# EAGLE design rfLED2 (EAGLE 9.2.2)
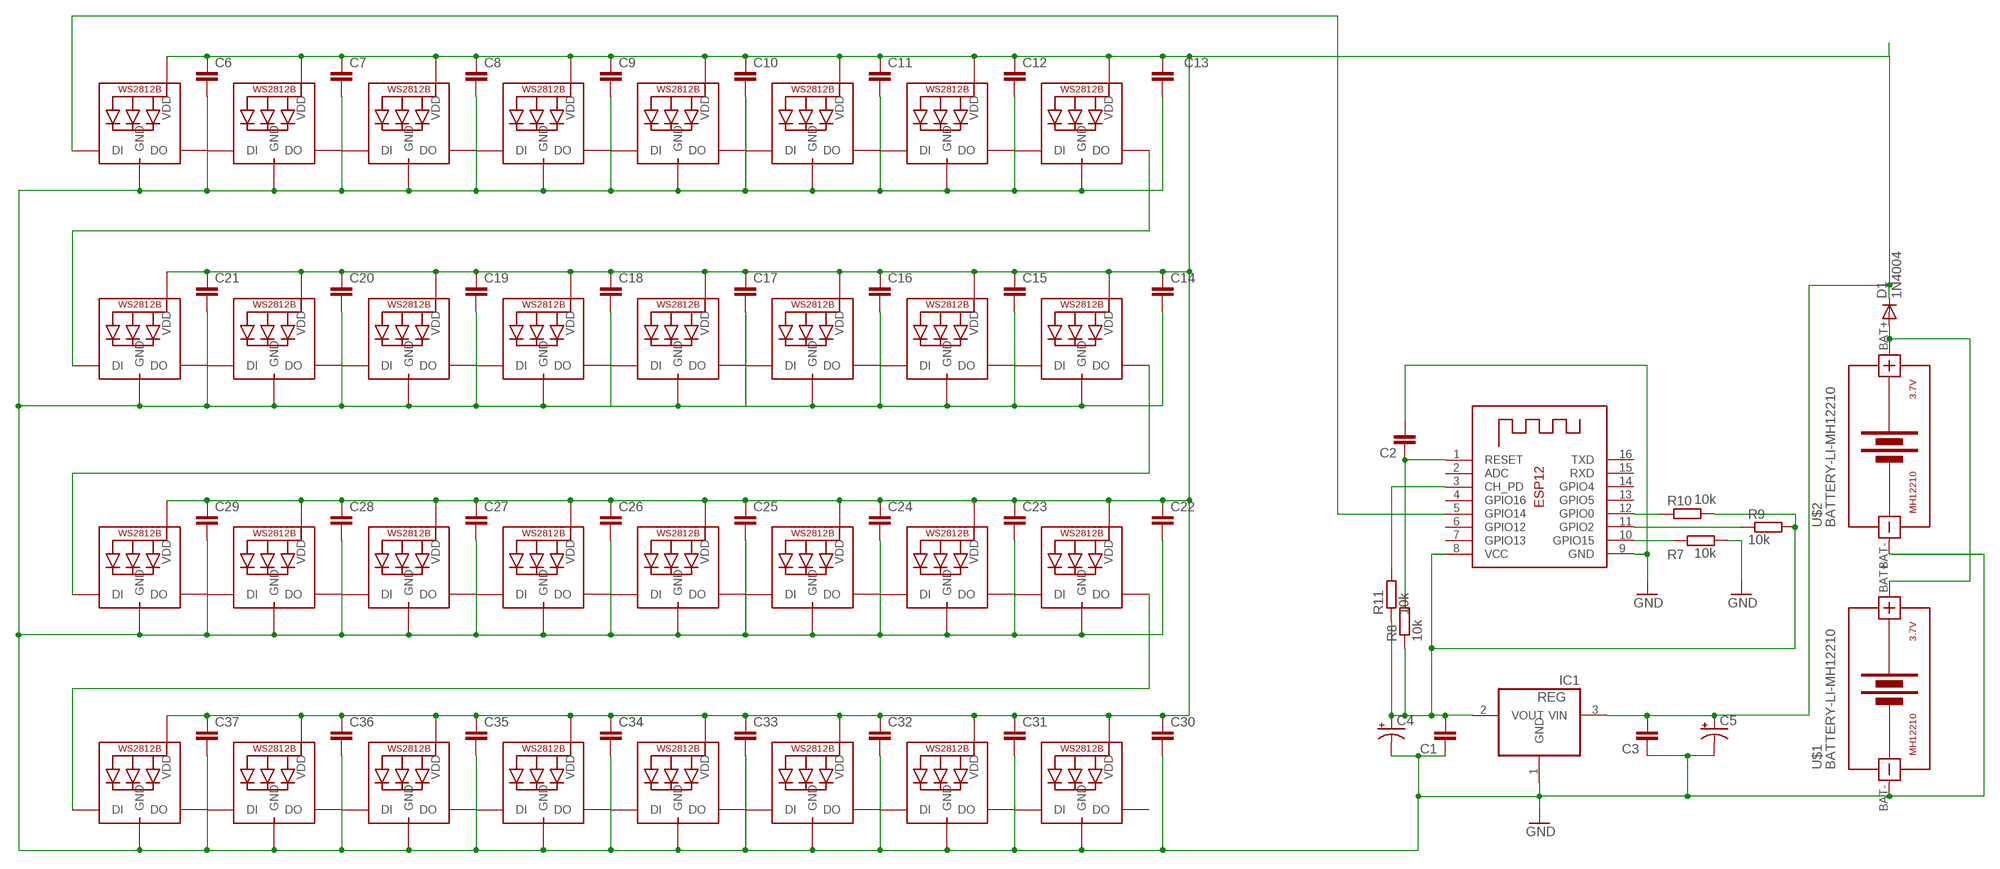
[diagram p0: schematic, sheet 1]

## Parts
C1  C  [C0805]
C2  C  [C0805]
C3  C  [C0805]
C4  CPOL-US150CLZ-1010  [150CLZ-1010]
C5  CPOL-US150CLZ-1010  [150CLZ-1010]
C6  C  [C0805]
C7  C  [C0805]
C8  C  [C0805]
C9  C  [C0805]
C10  C  [C0805]
C11  C  [C0805]
C12  C  [C0805]
C13  C  [C0805]
C14  C  [C0805]
C15  C  [C0805]
C16  C  [C0805]
C17  C  [C0805]
C18  C  [C0805]
C19  C  [C0805]
C20  C  [C0805]
C21  C  [C0805]
C22  C  [C0805]
C23  C  [C0805]
C24  C  [C0805]
C25  C  [C0805]
C26  C  [C0805]
C27  C  [C0805]
C28  C  [C0805]
C29  C  [C0805]
C30  C  [C0805]
C31  C  [C0805]
C32  C  [C0805]
C33  C  [C0805]
C34  C  [C0805]
C35  C  [C0805]
C36  C  [C0805]
C37  C  [C0805]
D1  1N4004  [DO41-10]
IC1  REG  REG1117  [SOT223]
LED1  WS2812B5050  [WS2812B]
LED2  WS2812B5050  [WS2812B]
LED3  WS2812B5050  [WS2812B]
LED4  WS2812B5050  [WS2812B]
LED5  WS2812B5050  [WS2812B]
LED6  WS2812B5050  [WS2812B]
LED7  WS2812B5050  [WS2812B]
LED8  WS2812B5050  [WS2812B]
LED9  WS2812B5050  [WS2812B]
LED10  WS2812B5050  [WS2812B]
LED11  WS2812B5050  [WS2812B]
LED12  WS2812B5050  [WS2812B]
LED13  WS2812B5050  [WS2812B]
LED14  WS2812B5050  [WS2812B]
LED15  WS2812B5050  [WS2812B]
LED16  WS2812B5050  [WS2812B]
LED17  WS2812B5050  [WS2812B]
LED18  WS2812B5050  [WS2812B]
LED19  WS2812B5050  [WS2812B]
LED20  WS2812B5050  [WS2812B]
LED21  WS2812B5050  [WS2812B]
LED22  WS2812B5050  [WS2812B]
LED23  WS2812B5050  [WS2812B]
LED24  WS2812B5050  [WS2812B]
LED25  WS2812B5050  [WS2812B]
LED26  WS2812B5050  [WS2812B]
LED27  WS2812B5050  [WS2812B]
LED28  WS2812B5050  [WS2812B]
LED29  WS2812B5050  [WS2812B]
LED30  WS2812B5050  [WS2812B]
LED31  WS2812B5050  [WS2812B]
LED32  WS2812B5050  [WS2812B]
R7  10k  RR1206  [R1206]
R8  10k  RR1206  [R1206]
R9  10k  RR1206  [R1206]
R10  10k  RR1206  [R1206]
R11  10k  RR1206  [R1206]
U$1  BATTERY-LI-MH12210  [BATTERY-LI-MH12210]
U$2  BATTERY-LI-MH12210  [BATTERY-LI-MH12210]
X1  ESP-12  [ESP-12]

## Nets
GND: C1.1 C2.2 C3.1 C4.- C5.- C6.2 C7.2 C8.2 C9.2 C10.2 C11.2 C12.2 C13.2 C14.2 C15.2 C16.2 C17.2 C18.2 C19.2 C20.2 C21.2 C22.2 C23.2 C24.2 C25.2 C26.2 C27.2 C28.2 C29.2 C30.2 C31.2 C32.2 C33.2 C34.2 C35.2 C36.2 C37.2 IC1.1(GND) LED1.3-GND(GND) LED2.3-GND(GND) LED3.3-GND(GND) LED4.3-GND(GND) LED5.3-GND(GND) LED6.3-GND(GND) LED7.3-GND(GND) LED8.3-GND(GND) LED9.3-GND(GND) LED10.3-GND(GND) LED11.3-GND(GND) LED12.3-GND(GND) LED13.3-GND(GND) LED14.3-GND(GND) LED15.3-GND(GND) LED16.3-GND(GND) LED17.3-GND(GND) LED18.3-GND(GND) LED19.3-GND(GND) LED20.3-GND(GND) LED21.3-GND(GND) LED22.3-GND(GND) LED23.3-GND(GND) LED24.3-GND(GND) LED25.3-GND(GND) LED26.3-GND(GND) LED27.3-GND(GND) LED28.3-GND(GND) LED29.3-GND(GND) LED30.3-GND(GND) LED31.3-GND(GND) LED32.3-GND(GND) R7.2 U$1.BAT- U$2.BAT- X1.9(GND)
N$1: LED1.2-DOUT(DO) LED2.4-DIN(DI)
N$2: LED2.2-DOUT(DO) LED3.4-DIN(DI)
N$3: LED3.2-DOUT(DO) LED4.4-DIN(DI)
N$4: LED4.2-DOUT(DO) LED5.4-DIN(DI)
N$5: LED5.2-DOUT(DO) LED6.4-DIN(DI)
N$6: LED6.2-DOUT(DO) LED7.4-DIN(DI)
N$7: LED7.2-DOUT(DO) LED8.4-DIN(DI)
N$8: C1.2 C4.+ IC1.2(VOUT) R8.1 R9.2 R10.2 R11.1 X1.8(VCC)
N$9: LED1.4-DIN(DI) X1.5(GPIO14)
N$11: R7.1 X1.10(GPIO15)
N$12: LED16.2-DOUT(DO) LED17.4-DIN(DI)
N$13: C2.1 R8.2 X1.1(RESET)
N$14: R10.1 X1.12(GPIO0)
N$15: R9.1 X1.11(GPIO2)
N$16: D1.A U$1.BAT+ U$2.BAT+
N$17: R11.2 X1.3(CH_PD)
N$18: LED9.2-DOUT(DO) LED10.4-DIN(DI)
N$19: LED10.2-DOUT(DO) LED11.4-DIN(DI)
N$20: LED11.2-DOUT(DO) LED12.4-DIN(DI)
N$21: LED12.2-DOUT(DO) LED13.4-DIN(DI)
N$22: LED13.2-DOUT(DO) LED14.4-DIN(DI)
N$23: LED14.2-DOUT(DO) LED15.4-DIN(DI)
N$24: LED15.2-DOUT(DO) LED16.4-DIN(DI)
N$25: LED17.2-DOUT(DO) LED18.4-DIN(DI)
N$26: LED18.2-DOUT(DO) LED19.4-DIN(DI)
N$27: LED19.2-DOUT(DO) LED20.4-DIN(DI)
N$28: LED20.2-DOUT(DO) LED21.4-DIN(DI)
N$29: LED21.2-DOUT(DO) LED22.4-DIN(DI)
N$30: LED22.2-DOUT(DO) LED23.4-DIN(DI)
N$31: LED23.2-DOUT(DO) LED24.4-DIN(DI)
N$32: LED25.2-DOUT(DO) LED26.4-DIN(DI)
N$33: LED26.2-DOUT(DO) LED27.4-DIN(DI)
N$34: LED27.2-DOUT(DO) LED28.4-DIN(DI)
N$35: LED28.2-DOUT(DO) LED29.4-DIN(DI)
N$36: LED29.2-DOUT(DO) LED30.4-DIN(DI)
N$37: LED30.2-DOUT(DO) LED31.4-DIN(DI)
N$38: LED31.2-DOUT(DO) LED32.4-DIN(DI)
N$39: LED8.2-DOUT(DO) LED9.4-DIN(DI)
N$42: LED24.2-DOUT(DO) LED25.4-DIN(DI)
VCC: C3.2 C5.+ C6.1 C7.1 C8.1 C9.1 C10.1 C11.1 C12.1 C13.1 C14.1 C15.1 C16.1 C17.1 C18.1 C19.1 C20.1 C21.1 C22.1 C23.1 C24.1 C25.1 C26.1 C27.1 C28.1 C29.1 C30.1 C31.1 C32.1 C33.1 C34.1 C35.1 C36.1 C37.1 D1.C IC1.3(VIN) LED1.1-VDD(VDD) LED2.1-VDD(VDD) LED3.1-VDD(VDD) LED4.1-VDD(VDD) LED5.1-VDD(VDD) LED6.1-VDD(VDD) LED7.1-VDD(VDD) LED8.1-VDD(VDD) LED9.1-VDD(VDD) LED10.1-VDD(VDD) LED11.1-VDD(VDD) LED12.1-VDD(VDD) LED13.1-VDD(VDD) LED14.1-VDD(VDD) LED15.1-VDD(VDD) LED16.1-VDD(VDD) LED17.1-VDD(VDD) LED18.1-VDD(VDD) LED19.1-VDD(VDD) LED20.1-VDD(VDD) LED21.1-VDD(VDD) LED22.1-VDD(VDD) LED23.1-VDD(VDD) LED24.1-VDD(VDD) LED25.1-VDD(VDD) LED26.1-VDD(VDD) LED27.1-VDD(VDD) LED28.1-VDD(VDD) LED29.1-VDD(VDD) LED30.1-VDD(VDD) LED31.1-VDD(VDD) LED32.1-VDD(VDD)
Unconnected: LED32.2-DOUT(DO) X1.2(ADC) X1.4(GPIO16) X1.6(GPIO12) X1.7(GPIO13) X1.13(GPIO5) X1.14(GPIO4) X1.15(RXD) X1.16(TXD)

## Library data of the parts
C1-C3 C6-C37 = eagle-ltspice:C: CAPACITOR, European symbol; SPICEMODEL: NONE; SPICEPREFIX: C
C4 C5 = adafruit:CPOL-US: POLARIZED CAPACITOR, American symbol
D1 = adafruit:1N4004: DIODE General purpose 1N400x type rectifier (With bigger pads) http://www.ladyada.net/library/pcb/eaglelibrary.html
IC1 = burr-brown:REG1117: 800mA and 1A Low Dropout (LDO) Positive Regulator 1.8V, 2.5V, 2.85V, 3.3V, 5V, and Adj; MPN: REG1117; OC_FARNELL: 1097566; OC_NEWARK: 14P6981
LED1-LED32 = adafruit:WS2812B
R7-R11 = eagle-ltspice:R: RESISTOR, European symbol; SPICEMODEL: NONE; SPICEPREFIX: R
U$1 U$2 = diy-modules:BATTERY-LI-MH12210: Lithium-Ion MH12210 Rechargeable Battery Panasonic NCR18650PF battery datasheet available here: https://industrial.panasonic.com/cdbs/www-data/pdf2/ACI4000/ACI4000C12.pdf Click here to find device on ebay.com <http://www.ebay.com/sch/ncr18650b+battery>
X1 = adafruit:ESP-12

## Board
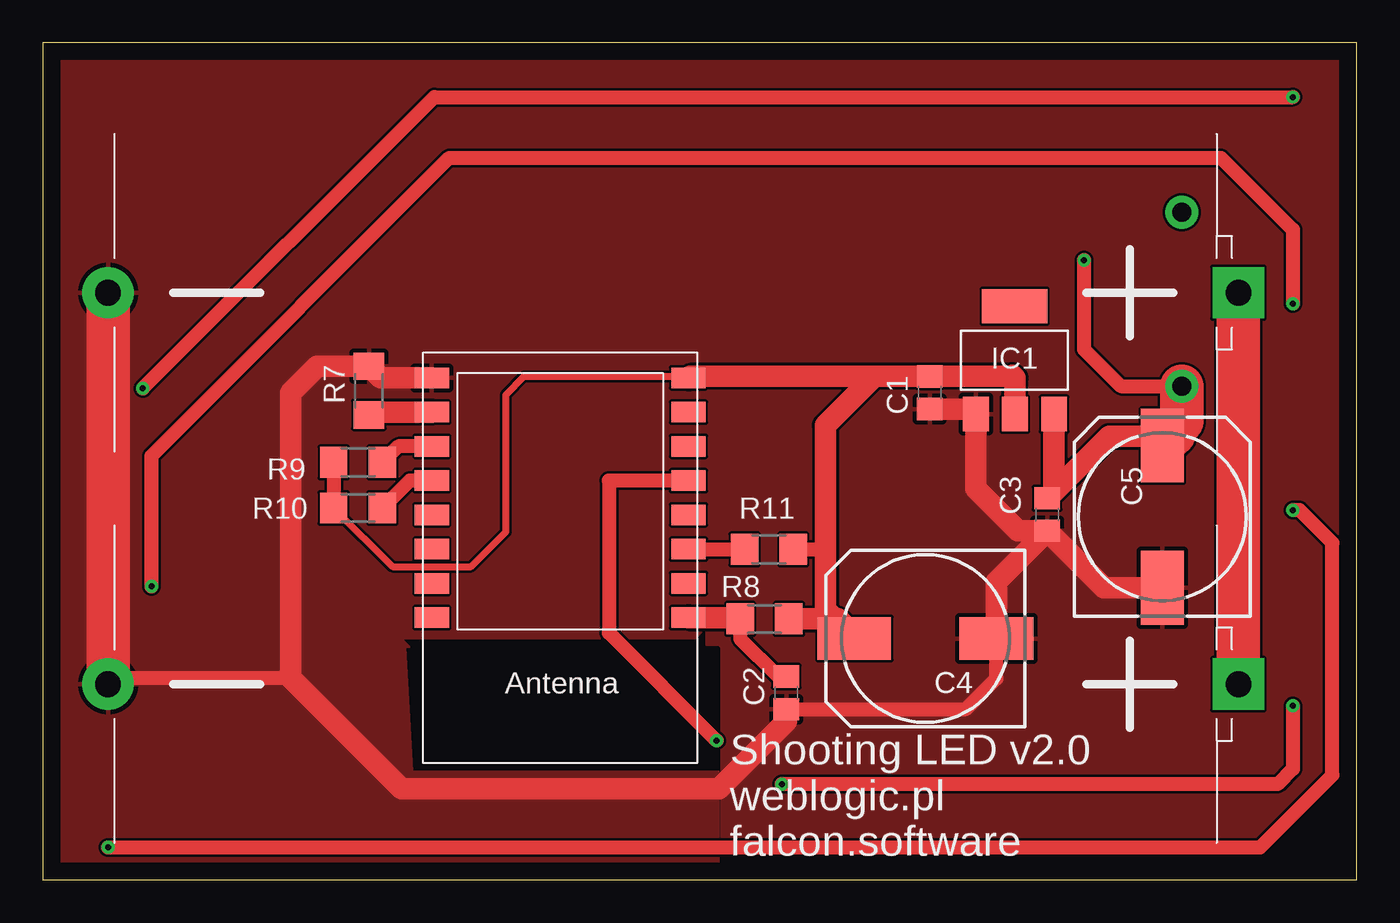
[diagram p1: board, top side]
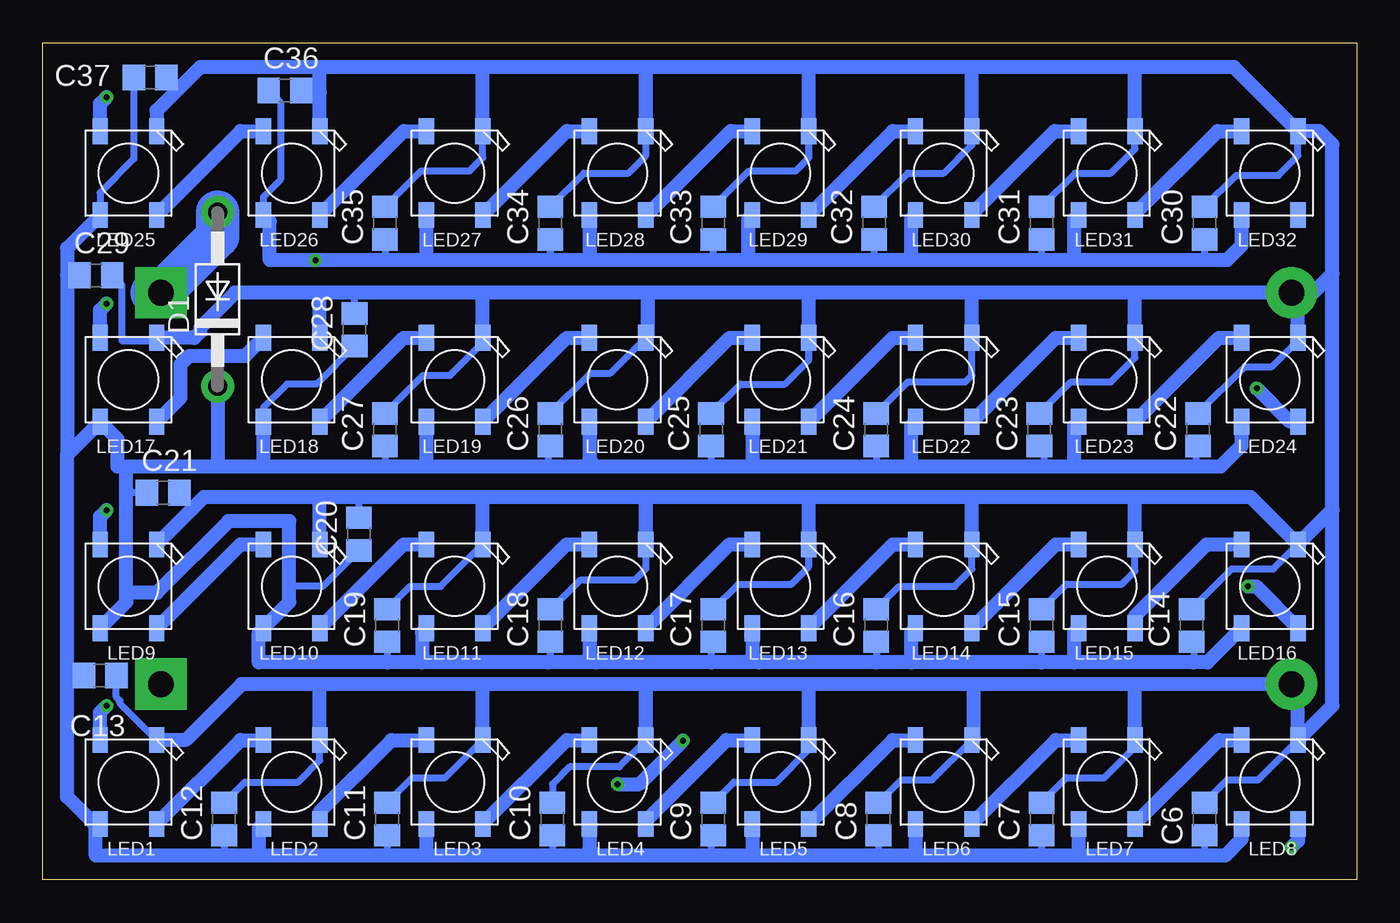
[diagram p2: board, bottom side, seen from below]

Size 76.76 x 48.88 mm. Coordinates in mm from the lower left corner, seen from the top.
Outline: 0,0 76.76,0 76.76,48.88 0,48.88 0,0
Copper layers (1*16): Top 0.035mm / dielectric 1.5mm / Bottom 0.035mm
Design rules "default": minimum track width 6mil, minimum drill 0.35mm, track to track 6mil, track to pad 6mil, pad to pad 6mil, via to via 6mil, smd to smd 6mil, copper to edge 40mil, drill to drill 6mil, minimum pad ring 10mil, minimum via ring 8mil, stop-mask expansion 4mil, vias tented up to drill 0mil, thermal gap 10mil

### Footprints (pad centres in the part's own frame; a part is rotated, then mirrored left to right if it is on the bottom)
C0805 = smd 1.3 x 1.5: 1 -0.95,0; 2 0.95,0
150CLZ-1010 = smd 4.3 x 2.5: + 4.15,0; - -4.15,0
DO41-10 = drill 1.118 pad 1.93: A 5.08,0; C -5.08,0
SOT223 = smd 1.499 x 2.007: 1 -2.261,-3.15; 2 0.025,-3.15; 3 2.311,-3.15 | smd 3.81 x 2.007: 4 0,3.15
WS2812B = smd 1.5 x 0.9: 1-VDD 2.45,-1.65; 2-DOUT 2.45,1.65; 3-GND -2.45,1.65; 4-DIN -2.45,-1.65
R1206 = smd 1.6 x 1.803: 1 -1.422,0; 2 1.422,0
BATTERY-LI-MH12210 = drill 1.5 pad 3 square: BAT+ -33.02,0 | drill 1.5 pad 3: BAT- 33.02,0
ESP-12 = smd 2 x 1.2: 1 -7.5,4.5; 2 -7.5,2.5; 3 -7.5,0.5; 4 -7.5,-1.5; 5 -7.5,-3.5; 6 -7.5,-5.5; 7 -7.5,-7.5; 8 -7.5,-9.5; 9 7.5,-9.5; 10 7.5,-7.5; 11 7.5,-5.5; 12 7.5,-3.5; 13 7.5,-1.5; 14 7.5,0.5; 15 7.5,2.5; 16 7.5,4.5

### Placement (x,y rotation side)
C1  51.82,28.45 90 top
C2  43.43,10.92 270 top
C3  58.67,21.34 90 top
C4  51.56,14.1 180 top
C5  65.41,21.21 90 top
C6  8.89,3.56 90 bottom
C7  18.41,3.56 90 bottom
C8  27.94,3.56 90 bottom
C9  37.59,3.56 90 bottom
C10  46.99,3.56 90 bottom
C11  56.64,3.56 90 bottom
C12  66.17,3.56 90 bottom
C13  73.41,11.94 0 bottom
C14  9.65,14.86 90 bottom
C15  18.41,14.86 90 bottom
C16  28.07,14.86 90 bottom
C17  37.59,14.86 90 bottom
C18  47.12,14.86 90 bottom
C19  56.64,14.86 90 bottom
C20  58.29,20.19 90 bottom
C21  69.72,22.61 0 bottom
C22  9.27,26.29 90 bottom
C23  18.54,26.29 90 bottom
C24  28.07,26.29 90 bottom
C25  37.72,26.29 90 bottom
C26  47.12,26.29 90 bottom
C27  56.77,26.29 90 bottom
C28  58.55,32.13 90 bottom
C29  73.66,35.31 0 bottom
C30  8.89,38.35 90 bottom
C31  18.41,38.35 90 bottom
C32  28.19,38.35 90 bottom
C33  37.59,38.35 90 bottom
C34  47.12,38.35 90 bottom
C35  56.77,38.35 90 bottom
C36  62.61,46.1 0 bottom
C37  70.48,46.86 0 bottom
D1  66.55,33.91 90 bottom
IC1  56.77,30.35 0 top
LED1  71.75,5.71 270 bottom
LED2  62.23,5.71 270 bottom
LED3  52.7,5.71 270 bottom
LED4  43.18,5.71 270 bottom
LED5  33.66,5.71 270 bottom
LED6  24.13,5.71 270 bottom
LED7  14.61,5.71 270 bottom
LED8  5.08,5.71 270 bottom
LED9  71.75,17.14 270 bottom
LED10  62.23,17.14 270 bottom
LED11  52.7,17.14 270 bottom
LED12  43.18,17.14 270 bottom
LED13  33.66,17.14 270 bottom
LED14  24.13,17.14 270 bottom
LED15  14.61,17.14 270 bottom
LED16  5.08,17.14 270 bottom
LED17  71.75,29.21 270 bottom
LED18  62.23,29.21 270 bottom
LED19  52.7,29.21 270 bottom
LED20  43.18,29.21 270 bottom
LED21  33.66,29.21 270 bottom
LED22  24.13,29.21 270 bottom
LED23  14.61,29.21 270 bottom
LED24  5.08,29.21 270 bottom
LED25  71.75,41.27 270 bottom
LED26  62.23,41.27 270 bottom
LED27  52.7,41.27 270 bottom
LED28  43.18,41.27 270 bottom
LED29  33.66,41.27 270 bottom
LED30  24.13,41.27 270 bottom
LED31  14.61,41.27 270 bottom
LED32  5.08,41.27 270 bottom
R7  19.05,28.57 90 top
R8  42.16,15.24 180 top
R9  18.41,24.38 180 top
R10  18.41,21.72 180 top
R11  42.42,19.3 180 top
U$1  36.83,11.43 180 top
U$2  36.83,34.29 180 top
X1  30.23,19.81 180 top

### Tracks (layer width: path | path; a pad name or v marks a point on that pad's centre or on a via)
GND
  Top 0.813: C2.2 53.91,9.97 55.71,11.77 C4.- | U$1.BAT- 4.19,11.81 14.48,11.81
  Top 1.27: C5.- 62,17.06 C3.1 | C3.1 56.96,20.39 54.51,22.84 IC1.1 54.21,27.5 C1.1 | C3.1 55.71,17.42 C4.- | X1.9 19.73,29.31 R7.2 16.03,30 14.48,28.45 14.48,11.81 20.95,5.33 39.5,5.33 43.43,9.27 C2.2
  Top 2.54: U$2.BAT- U$1.BAT-
  Bottom 0.406: LED1.3-GND 72.26,10.32 72.26,10.48 72.46,10.67 C13.2 | C12.2 64.96,5.71 61.85,5.71 60.58,6.98 LED2.3-GND | C11.2 55.18,5.97 53.25,5.97 LED3.3-GND | LED4.3-GND 43.09,6.6 45.97,6.6 46.99,5.59 C10.2 | C9.2 36.38,5.71 33.91,5.71 32.01,7.62 LED5.3-GND | C8.2 26.6,5.84 24.8,5.84 LED6.3-GND | C7.2 16.95,5.97 14.73,5.97 12.96,7.75 LED7.3-GND | C6.2 7.55,5.84 5.75,5.84 LED8.3-GND | C21.2 68.03,21.86 68.03,21.67 | C20.2 58.29,22.35 | C19.2 55.31,17.14 53.51,17.14 LED11.3-GND | C18.2 47.06,15.81 45.34,17.53 42.16,17.53 41.53,18.16 LED12.3-GND | C17.2 36.13,17.27 33.02,17.27 32,18.29 LED13.3-GND | C16.2 26.73,17.14 23.5,17.14 22.48,18.16 22.48,20.07 | C15.2 16.95,17.27 13.72,17.27 12.96,18.03 LED15.3-GND | C14.2 7.3,18.16 4.86,18.16 LED16.3-GND | C29.2 72.14,34.73 72.14,31.5 70.27,31.5 LED17.3-GND | C28.2 58.55,34.16 58.42,34.29 | C27.2 54.54,29.46 52.96,29.46 51.05,31.37 LED19.3-GND | C26.2 44.77,29.59 43.6,29.59 LED20.3-GND | C25.2 36,28.96 33.4,28.96 32.01,30.35 LED21.3-GND | C24.2 26.22,29.08 22.86,29.08 22.48,29.46 LED22.3-GND | C23.2 16.7,29.08 14.35,29.08 12.96,30.48 LED23.3-GND | C22.2 6.54,29.97 4.95,29.97 3.43,31.5 LED24.3-GND | C37.2 69.2,46.53 68.5,46.53 | C36.2 61.53,45.97 60.58,45.97 | C35.2 54.67,41.4 51.82,41.4 51.05,42.16 LED27.3-GND | C34.2 45.15,41.27 42.55,41.27 41.53,42.29 LED28.3-GND | C33.2 35.49,41.4 32.77,41.4 32,42.16 32.01,42.16 LED29.3-GND | C32.2 26.22,41.27 24.13,41.27 22.48,42.92 LED30.3-GND | C31.2 16.44,41.27 14.35,41.27 12.96,42.67 LED31.3-GND | C30.2 7.05,41.15 4.57,41.15 3.43,42.29 LED32.3-GND
  Bottom 0.813: 13.08,47.46 7.17,47.46 LED32.3-GND 2.2,43.73 1.42,42.95 1.42,35.41 | 13.08,47.46 22.61,47.46 | 22.61,47.46 31.88,47.46 | 31.88,47.46 41.53,47.46 | 41.53,47.46 51.18,47.46 | 51.18,47.46 60.45,47.46 | 60.45,47.46 67.56,47.46 68.5,46.53 70.11,44.92 LED25.3-GND | LED26.3-GND 60.58,45.97 60.58,47.34 60.45,47.46 | LED27.3-GND 51.05,47.34 51.18,47.46 | LED28.3-GND 41.53,47.46 | LED29.3-GND 32.01,47.34 31.88,47.46 | LED30.3-GND 22.48,47.34 22.61,47.46 | LED31.3-GND 12.96,47.34 13.08,47.46 | LED24.3-GND 3.43,33.91 U$2.BAT- | U$2.BAT- 2.54,34.29 1.42,35.41 | 1.42,21.6 LED16.3-GND 6.19,22.35 13.21,22.35 | 1.42,21.6 1.42,35.41 | 1.42,21.6 1.42,10.17 LED8.3-GND 3.43,11.05 U$1.BAT- 12.95,11.43 | U$2.BAT- 13.08,34.29 | 13.08,34.29 22.61,34.29 | 22.61,34.29 32,34.29 | 32,34.29 41.4,34.29 | 41.4,34.29 51.05,34.29 | 51.05,34.29 58.42,34.29 60.58,34.29 | 60.58,34.29 65.53,34.29 67.56,32.26 67.56,32 67.91,31.66 LED17.3-GND | LED18.3-GND 60.58,34.29 | LED19.3-GND 51.05,34.29 | LED20.3-GND 41.4,31.79 41.4,34.29 | LED21.3-GND 32,34.29 | LED22.3-GND 22.48,34.16 22.61,34.29 | LED23.3-GND 12.96,34.16 13.08,34.29 | LED9.3-GND 68.03,21.67 67.35,22.35 60.71,22.35 | 13.21,22.35 22.48,22.35 | 22.48,22.35 32,22.35 | 32,22.35 41.66,22.35 | 41.66,22.35 51.05,22.35 | 51.05,22.35 58.29,22.35 60.71,22.35 | LED10.3-GND 60.58,22.23 60.71,22.35 | LED11.3-GND 51.05,22.35 | LED12.3-GND 41.53,22.23 41.66,22.35 | LED13.3-GND 32,22.35 | LED14.3-GND 22.48,20.07 22.48,22.35 | LED15.3-GND 12.96,22.1 13.21,22.35 | 12.95,11.43 22.35,11.43 | 22.35,11.43 32,11.43 | 32,11.43 41.4,11.43 | 41.4,11.43 50.8,11.43 | 50.8,11.43 60.58,11.43 | 60.58,11.43 65.15,11.43 68.42,8.16 LED1.3-GND
  Bottom 0.813: LED7.3-GND 12.95,11.43 | LED6.3-GND 22.35,8.29 22.35,11.43 | LED5.3-GND 32.01,11.43 32,11.43 | LED4.3-GND 41.53,11.3 41.4,11.43 | LED3.3-GND 51.05,11.18 50.8,11.43 | 60.58,11.43 | LED2.3-GND 60.58,11.43
  pour Top: 0,48.9 76.83,48.9 76.83,0 39.62,0 39.62,13.59 39.5,13.72 38.73,13.72 38.73,14.73 38.1,14.1 21.08,14.1 21.08,13.97 21.46,13.59 21.21,13.59 21.59,6.35 39.51,6.35 39.5,-0.2 0,0.13
N$1
  Bottom 0.813: LED1.2-DOUT 65.2,8.16 LED2.4-DIN
N$2
  Bottom 0.813: LED2.2-DOUT 60.58,3.97 56.39,8.16 LED3.4-DIN
N$3
  Bottom 0.813: LED3.2-DOUT 46.16,8.16 LED4.4-DIN
N$4
  Bottom 0.813: LED4.2-DOUT 41.53,3.46 36.83,8.16 LED5.4-DIN
N$5
  Bottom 0.813: LED5.2-DOUT 27.11,8.16 LED6.4-DIN
N$6
  Bottom 0.813: LED6.2-DOUT 17.58,8.16 LED7.4-DIN
N$7
  Bottom 0.813: LED7.2-DOUT 8.05,8.16 LED8.4-DIN
N$8
  Top 0.406: R10.2 20.42,18.29 25.02,18.29 27.05,20.32 27.05,28.32 28.13,29.4 37.81,29.4
  Top 0.813: R9.2 R10.2 | R11.1 45.72,19.3 45.59,19.43
  Top 1.27: IC1.2 56.79,29.31 56.64,29.46 56.58,29.4 C1.2 48.58,29.4 | 48.58,29.4 45.72,26.54 45.72,19.3 45.72,15.79 C4.+ 47.5,14.18 46.44,15.24 R8.1 | 48.58,29.4 37.81,29.4 X1.8
N$9  (via drill 0.35)
  Top 0.813: X1.5 33.08,23.31 33.08,14.42 v39.37,8.13 | v73.03,10.16 73.03,6.48 72.14,5.59 v43.18,5.59
  Bottom 0.813: LED1.4-DIN 73.41,9.78 v73.03,10.16 | v43.18,5.59 41.91,5.59 v39.37,8.13
N$11
  Top 1.27: X1.10 19.21,27.31 R7.1
N$12  (via drill 0.35)
  Top 0.813: v6.35,17.14 6.35,24.77 23.75,42.16 68.83,42.16 73.03,37.97 v73.03,33.66
  Bottom 0.813: v6.35,17.14 5.88,17.14 LED16.2-DOUT | LED17.4-DIN 73.41,33.27 v73.03,33.66
N$13
  Top 0.813: R8.2 40.74,14.1 42.97,11.87 C2.1
  Top 1.27: X1.1 40.67,15.31 R8.2
N$14
  Top 0.813: X1.12 21.43,23.31 R10.1
N$15
  Top 0.813: X1.11 20.77,25.31 R9.1
N$16
  Top 2.54: U$1.BAT+ U$2.BAT+
  Bottom 2.54: 70.36,34.29 U$2.BAT+ 66.55,37.59 D1.A
N$17
  Top 0.813: X1.3 40.99,19.31 R11.2
N$18
  Bottom 0.813: LED9.2-DOUT 65.2,19.59 LED10.4-DIN
N$19
  Bottom 0.813: LED10.2-DOUT 55.68,19.59 LED11.4-DIN
N$20
  Bottom 0.813: LED11.2-DOUT 46.16,19.59 LED12.4-DIN
N$21
  Bottom 0.813: LED12.2-DOUT 36.63,19.59 LED13.4-DIN
N$22
  Bottom 0.813: LED13.2-DOUT 27.11,19.59 LED14.4-DIN
N$23
  Bottom 0.813: LED14.2-DOUT 17.58,19.59 LED15.4-DIN
N$24
  Bottom 0.813: LED15.2-DOUT 12.96,15.4 8.76,19.59 LED16.4-DIN
N$25
  Bottom 0.813: LED17.2-DOUT 68.71,28.16 68.71,30.1 68.2,30.61 64.93,30.61 LED18.4-DIN
N$26
  Bottom 0.813: LED18.2-DOUT 55.68,31.66 LED19.4-DIN
N$27
  Bottom 0.813: LED19.2-DOUT 46.16,31.66 LED20.4-DIN
N$28
  Bottom 0.813: LED20.2-DOUT 36.63,31.66 LED21.4-DIN
N$29
  Bottom 0.813: LED21.2-DOUT 27.11,31.66 LED22.4-DIN
N$30
  Bottom 0.813: LED22.2-DOUT 17.58,31.66 LED23.4-DIN
N$31
  Bottom 0.813: LED23.2-DOUT 8.05,31.66 LED24.4-DIN
N$32
  Bottom 0.813: LED25.2-DOUT 65.2,43.73 LED26.4-DIN
N$33
  Bottom 0.813: LED26.2-DOUT 55.68,43.73 LED27.4-DIN
N$34
  Bottom 0.813: LED27.2-DOUT 46.16,43.73 LED28.4-DIN
N$35
  Bottom 0.813: LED28.2-DOUT 41.48,38.83 36.58,43.73 LED29.4-DIN
N$36
  Bottom 0.813: LED29.2-DOUT 27.11,43.73 LED30.4-DIN
N$37
  Bottom 0.813: LED30.2-DOUT 22.48,38.9 17.65,43.73 LED31.4-DIN
N$38
  Bottom 0.813: LED31.2-DOUT 12.96,38.9 8.13,43.73 LED32.4-DIN
N$39  (via drill 0.35)
  Top 0.813: v3.81,1.91 71.12,1.91 75.34,6.12 75.34,19.68 73.43,21.59 v73.03,21.59
  Bottom 0.813: LED8.2-DOUT 3.43,2.29 v3.81,1.91 | LED9.4-DIN 73.41,21.21 v73.03,21.59
N$42  (via drill 0.35)
  Top 0.813: v5.84,28.7 22.86,45.72 v73.03,45.72
  Bottom 0.813: v5.84,28.7 3.9,26.76 LED24.2-DOUT | LED25.4-DIN 73.41,45.34 v73.03,45.72
VCC  (via drill 0.35)
  Top 0.813: v60.83,36.2 60.83,30.99 62.99,28.83 D1.C
  Top 1.27: 65.79,26.04 65.66,25.91 | 65.66,25.91 65.66,25.61 C5.+ | 65.66,25.91 62.3,25.91 C3.2 59.08,22.69 IC1.3
  Top 2.54: C5.+ 66.08,26.04 | D1.C 66.55,26.8 65.66,25.91
  Bottom 0.406: C13.1 75.34,11.94 | C12.1 66.17,1.42 | C11.1 56.64,1.42 | C10.1 46.99,1.42 | C9.1 37.72,2.48 37.72,1.42 | C8.1 27.94,1.42 | C7.1 18.41,1.55 18.54,1.42 | C6.1 8.89,1.42 | C21.1 71.75,22.61 71.88,22.73 | C20.1 60.39,17.14 62.36,17.14 | C19.1 56.64,12.7 | C18.1 47.12,12.83 47.24,12.7 | C17.1 37.72,13.78 37.72,12.7 | C16.1 28.07,12.7 | C15.1 18.41,12.7 | C14.1 9.53,13.78 9.53,12.7 | C29.1 75.34,35.31 | C28.1 60.77,28.96 62.48,28.96 63.88,27.56 LED18.1-VDD | C22.1 9.4,25.21 9.4,24.13 | C23.1 18.29,25.09 18.29,24.13 | C24.1 28.07,24.13 | C25.1 37.72,24.13 | C26.1 47.24,25.21 47.24,24.13 | C27.1 56.77,24.26 56.64,24.13 | C37.1 71.44,42.1 73.41,40.13 LED25.1-VDD | C36.1 62.87,45.41 62.87,40.89 63.88,39.88 LED26.1-VDD | C30.1 8.89,36.32 8.76,36.2 | C31.1 18.41,36.32 18.29,36.2 | C32.1 28.19,36.2 | C33.1 37.59,36.32 37.72,36.2 | C34.1 47.12,36.32 46.99,36.2 | C35.1 56.77,36.2
  Bottom 0.813: LED8.1-VDD 6.73,2.38 7.68,1.42 8.89,1.42 16.51,1.42 | 16.51,1.42 18.54,1.42 26.04,1.42 | 26.04,1.42 27.94,1.42 35.56,1.42 | 35.56,1.42 37.72,1.42 44.45,1.42 | 44.45,1.42 46.99,1.42 54.61,1.42 | 54.61,1.42 56.64,1.42 64.14,1.42 | 64.14,1.42 66.17,1.42 73.66,1.42 73.66,3.01 LED1.1-VDD 73.75,3.27 75.34,4.85 75.34,11.94 75.34,24.83 | LED16.1-VDD 8.72,12.7 9.53,12.7 16.51,12.7 | 16.51,12.7 18.41,12.7 26.04,12.7 | 26.04,12.7 28.07,12.7 34.92,12.7 | 34.92,12.7 37.72,12.7 44.45,12.7 | 44.45,12.7 47.24,12.7 54.61,12.7 | 54.61,12.7 56.64,12.7 64.14,12.7 64.14,14.44 LED10.1-VDD 62.36,16.22 62.36,17.14 62.36,20.95 65.91,20.95 70.1,16.76 71.88,16.76 | LED11.1-VDD 54.61,14.44 54.61,12.7 | LED12.1-VDD 44.83,13.08 44.45,12.7 | LED2.1-VDD 64.14,3.01 64.14,1.42 | LED3.1-VDD 54.35,1.68 54.61,1.42 | LED4.1-VDD 44.83,1.8 44.45,1.42 | LED5.1-VDD 35.3,1.68 35.56,1.42 | LED6.1-VDD 25.78,1.68 26.04,1.42 | LED7.1-VDD 16.25,1.68 16.51,1.42 | LED15.1-VDD 16.51,14.44 16.51,12.7 | LED14.1-VDD 26.04,14.44 26.04,12.7 | LED13.1-VDD 35.3,13.08 34.92,12.7 | LED24.1-VDD 6.73,25.36 7.96,24.13 9.4,24.13 16.51,24.13 | 16.51,24.13 18.29,24.13 26.04,24.13 | 26.04,24.13 28.07,24.13 35.56,24.13 | 35.56,24.13 37.72,24.13 44.45,24.13 | 44.45,24.13 47.24,24.13 54.61,24.13 | 54.61,24.13 56.64,24.13 64.14,24.13 | 64.14,24.13 66.67,24.13 | 66.67,24.13 71.88,24.13 | 71.88,24.13 72.39,24.13 72.39,25.75 LED17.1-VDD 75.34,24.83 | LED18.1-VDD 63.88,24.39 64.14,24.13 | LED19.1-VDD 54.35,24.39 54.61,24.13 | LED20.1-VDD 44.83,24.51 44.45,24.13 | LED21.1-VDD 35.3,24.39 35.56,24.13 | LED22.1-VDD 26.04,26.5 26.04,24.13 | LED23.1-VDD 16.51,26.5 16.51,24.13
  Bottom 0.813: LED32.1-VDD 6.73,37.05 7.58,36.2 8.76,36.2 16.51,36.2 | 16.51,36.2 18.29,36.2 26.04,36.2 | 26.04,36.2 28.19,36.2 35.56,36.2 | 35.56,36.2 37.72,36.2 45.09,36.2 | 45.09,36.2 46.99,36.2 54.61,36.2 | 54.61,36.2 56.77,36.2 v60.83,36.2 63.5,36.2 63.5,38.45 LED26.1-VDD | LED25.1-VDD 75.34,36.89 75.34,35.31 75.34,24.83 | LED27.1-VDD 54.35,36.45 54.61,36.2 | D1.C 66.55,24.26 66.67,24.13 | LED28.1-VDD 44.83,36.45 45.09,36.2 | LED29.1-VDD 35.56,38.57 35.56,36.2 | LED30.1-VDD 26.04,38.57 26.04,36.2 | LED31.1-VDD 16.51,38.57 16.51,36.2 | LED9.1-VDD 71.88,16.22 71.88,16.76 | 71.88,16.76 71.88,22.73 71.88,24.13

### Text on the board
tNames: Shooting LED v2.0 / weblogic.pl / falcon.software